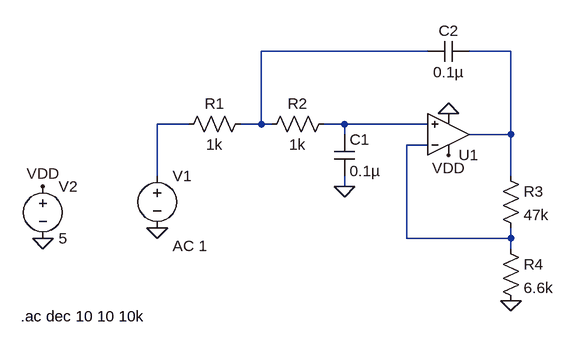
[diagram p0: schematic Active_Filter.asc]
Active_Filter.asc, the LTspice schematic file:
Version 4
SHEET 1 880 680
WIRE 512 -96 256 -96
WIRE 640 -96 576 -96
WIRE 144 16 96 16
WIRE 256 16 256 -96
WIRE 256 16 224 16
WIRE 272 16 256 16
WIRE 384 16 352 16
WIRE 512 16 384 16
WIRE 384 32 384 16
WIRE 640 32 640 -96
WIRE 640 32 576 32
WIRE 512 48 480 48
WIRE 96 96 96 16
WIRE 640 96 640 32
WIRE 384 112 384 96
WIRE 480 192 480 48
WIRE 640 192 640 176
WIRE 640 192 480 192
WIRE 640 208 640 192
FLAG -80 192 0
FLAG 96 176 0
FLAG -80 112 VDD
FLAG 544 64 VDD
FLAG 544 0 0
FLAG 384 112 0
FLAG 640 288 0
SYMBOL voltage 96 80 R0
WINDOW 123 24 124 Left 2
WINDOW 39 0 0 Left 0
SYMATTR InstName V1
SYMATTR Value ""
SYMATTR Value2 AC 1
SYMBOL voltage -80 96 R0
WINDOW 123 0 0 Left 0
WINDOW 39 0 0 Left 0
SYMATTR InstName V2
SYMATTR Value 5
SYMBOL OpAmps\\UniversalOpAmp2 544 32 M180
SYMATTR InstName U1
SYMBOL res 240 0 R90
WINDOW 0 0 56 VBottom 2
WINDOW 3 32 56 VTop 2
SYMATTR InstName R1
SYMATTR Value 1k
SYMBOL res 368 0 R90
WINDOW 0 0 56 VBottom 2
WINDOW 3 32 56 VTop 2
SYMATTR InstName R2
SYMATTR Value 1k
SYMBOL cap 368 32 R0
SYMATTR InstName C1
SYMATTR Value 0.1µ
SYMBOL res 624 80 R0
SYMATTR InstName R3
SYMATTR Value 47k
SYMBOL res 624 192 R0
SYMATTR InstName R4
SYMATTR Value 6.6k
SYMBOL cap 576 -112 R90
WINDOW 0 0 32 VBottom 2
WINDOW 3 32 32 VTop 2
SYMATTR InstName C2
SYMATTR Value 0.1µ
TEXT -114 312 Left 2 !.ac dec 10 10 10k

The netlist it stands for:
* Active_Filter.asc
V1 N003 0 AC 1
V2 VDD 0 5
XU1 N004 N005 VDD 0 N002 level2 Avol=1Meg GBW=10Meg Slew=10Meg Ilimit=25m Rail=0 Vos=0 En=0 Enk=0 In=0 Ink=0 Rin=500Meg  ; pins In+ In- V+ V- OUT
R1 N001 N003 1k
R2 N004 N001 1k
C1 N004 0 0.1µ
R3 N002 N005 47k
R4 N005 0 6.6k
C2 N002 N001 0.1µ
.ac dec 10 10 10k
.lib UniversalOpAmp2.lib
.backanno
.end